# EAGLE design Adapter RepRap (EAGLE 8.1.1)
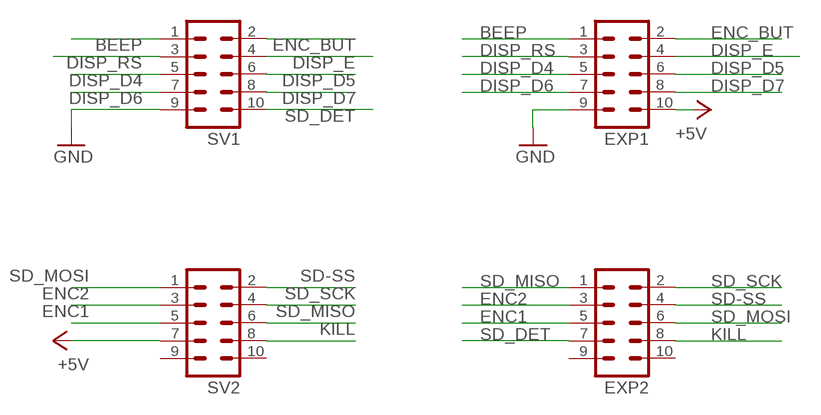
[diagram p0: schematic, sheet 1]

## Parts
EXP1  ML10  [ML10]
EXP2  ML10  [ML10]
SV1  ML10  [ML10]
SV2  ML10  [ML10]

## Nets
+5V: EXP1.10 SV2.7
BEEP: EXP1.1 SV1.1
DISP_D4: EXP1.5 SV1.5
DISP_D5: EXP1.6 SV1.6
DISP_D6: EXP1.7 SV1.7
DISP_D7: EXP1.8 SV1.8
DISP_E: EXP1.4 SV1.4
DISP_RS: EXP1.3 SV1.3
ENC1: EXP2.5 SV2.5
ENC2: EXP2.3 SV2.3
ENC_BUT: EXP1.2 SV1.2
GND: EXP1.9 SV1.9
KILL: EXP2.8 SV2.8
SD-SS: EXP2.4 SV2.2
SD_DET: EXP2.7 SV1.10
SD_MISO: EXP2.1 SV2.6
SD_MOSI: EXP2.6 SV2.1
SD_SCK: EXP2.2 SV2.4
Unconnected: EXP2.9 EXP2.10 SV2.9 SV2.10

## Library data of the parts
EXP1 EXP2 SV1 SV2 = con-harting-ml:ML10: HARTING; OC_FARNELL: unknown; OC_NEWARK: unknown

## Board
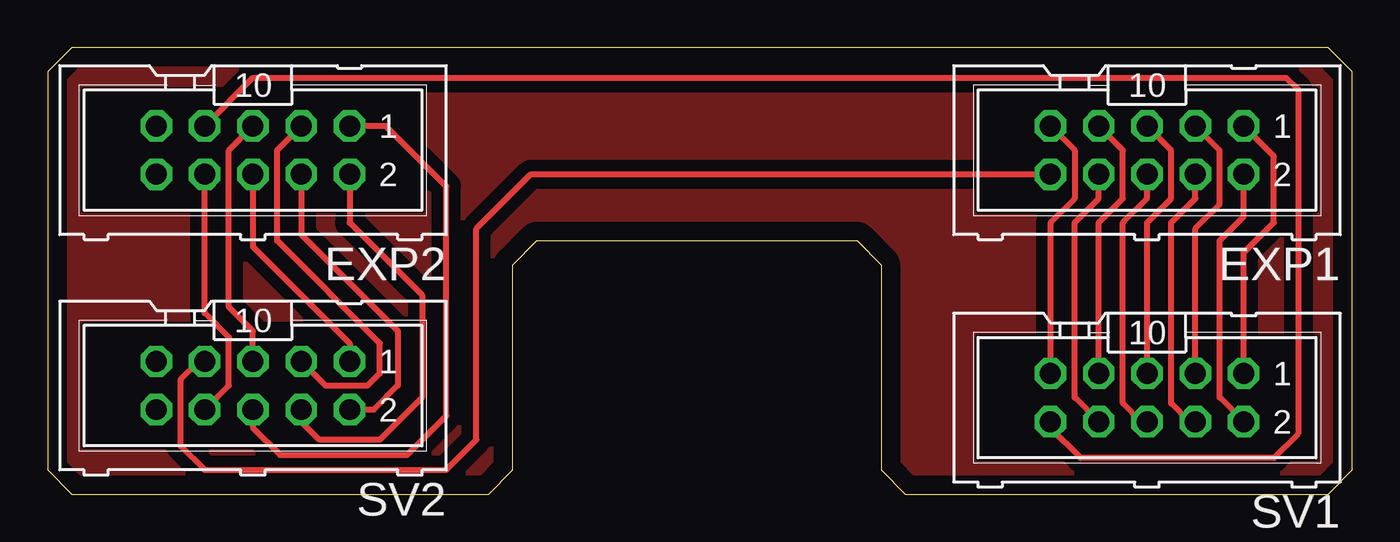
[diagram p1: board, top side]
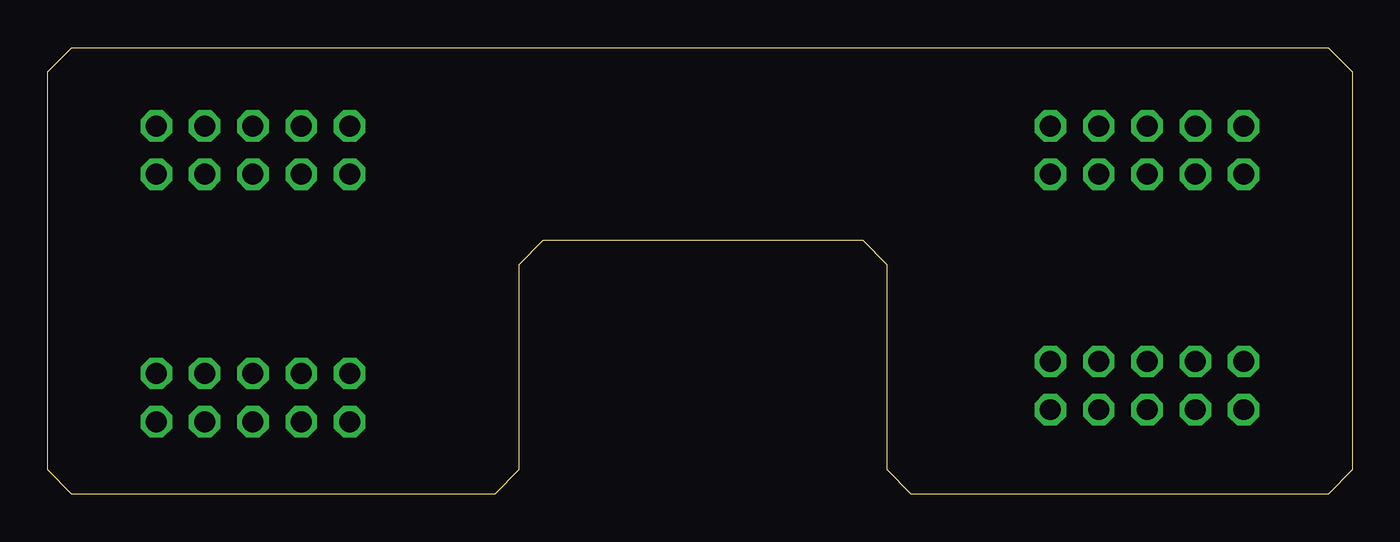
[diagram p2: board, bottom side, seen from below]

Size 68.58 x 23.5 mm. Coordinates in mm from the lower left corner, seen from the top.
Outline: 0,22.22 0,1.27 1.27,0 23.18,0 24.45,1.27 24.45,12.06 25.72,13.33 42.55,13.33 43.81,12.06 43.81,1.27 45.08,0 67.31,0 68.58,1.27 68.58,22.22 67.31,23.49 1.27,23.49 0,22.22
Copper layers (1*16): Top 0.035mm / dielectric 1.5mm / Bottom 0.035mm
Design rules "EagleDesignRules": minimum track width 0.2mm, minimum drill 0.3mm, track to track 0.2mm, track to pad 0.2mm, pad to pad 0.2mm, via to via 0.2mm, smd to smd 0.2mm, copper to edge 1mm, drill to drill 0.2mm, minimum pad ring 10mil, minimum via ring 8mil, stop-mask expansion 4mil, vias tented up to drill 0mil, thermal gap 0.25mm

### Footprints (pad centres in the part's own frame; a part is rotated, then mirrored left to right if it is on the bottom)
ML10 = drill 1.1 octagon: 1 -5.08,-1.27; 2 -5.08,1.27; 3 -2.54,-1.27; 4 -2.54,1.27; 5 0,-1.27; 6 0,1.27; 7 2.54,-1.27; 8 2.54,1.27; 9 5.08,-1.27; 10 5.08,1.27

### Placement (x,y rotation side)
EXP1  57.78,18.1 180 top
EXP2  10.8,18.1 180 top
SV1  57.78,5.08 180 top
SV2  10.8,5.71 180 top

### Tracks (layer width: path | path; a pad name or v marks a point on that pad's centre or on a via)
+5V
  Top 0.305: SV2.7 7.94,6.98 6.99,6.03 6.99,2.54 8.25,1.27 20.95,1.27 22.54,2.86 22.54,13.97 25.4,16.83 EXP1.10
BEEP
  Top 0.305: SV1.1 62.86,12.7 64.45,14.29 64.45,17.78 EXP1.1
DISP_D4
  Top 0.305: SV1.5 57.78,14.29 59.05,15.56 59.05,18.1 EXP1.5
DISP_D5
  Top 0.305: 57.47,3.81 56.52,4.76 56.52,14.29 57.78,15.56 EXP1.6
  Top 0.406: SV1.6 57.47,3.81
DISP_D6
  Top 0.305: SV1.7 55.25,14.29 56.52,15.56 56.52,18.1 EXP1.7
DISP_D7
  Top 0.305: SV1.8 53.97,5.08 53.97,14.29 55.25,15.56 EXP1.8
DISP_E
  Top 0.305: 60.01,3.81 59.05,4.76 59.05,14.29 60.33,15.56 EXP1.4
  Top 0.406: SV1.4 60.01,3.81
DISP_RS
  Top 0.305: SV1.3 60.33,13.97 61.59,15.24 61.59,18.1 EXP1.3
ENC1
  Top 0.305: SV2.5 10.8,8.57 9.52,9.84 9.52,18.1 EXP2.5
ENC2
  Top 0.305: SV2.3 14.6,5.72 16.83,5.72 17.46,6.35 17.46,7.94 12.06,13.33 12.06,18.1 EXP2.3
ENC_BUT
  Top 0.305: SV1.2 61.59,5.08 61.59,13.33 62.86,14.6 EXP1.2
GND
  Top 0.305: EXP1.9 53.97,18.1 53.97,15.56 52.7,14.29 SV1.9
KILL
  Top 0.305: SV2.8 9.52,5.72 9.52,8.25 8.25,9.53 EXP2.8
N$1
  pour Top (isolate 0.61): 1.27,23.5 67.31,23.5 68.58,22.23 68.58,1.27 67.31,0 45.08,0 43.81,1.27 43.81,12.06 42.55,13.33 25.72,13.33 24.45,12.06 24.45,1.27 23.18,0 1.27,0 0,1.27 0,22.23
N$2
  cutout Top (isolate 0.61): 1.9,21.27 19.69,21.27 19.69,14.92 1.9,14.92
N$3
  cutout Top (isolate 0.61): 48.89,14.92 66.67,14.92 66.67,21.27 48.89,21.27
N$4
  cutout Top (isolate 0.61): 48.89,1.91 66.67,1.91 66.67,8.25 48.89,8.25
N$5
  cutout Top (isolate 0.61): 1.9,2.54 19.69,2.54 19.69,8.89 1.9,8.89
SD-SS
  Top 0.305: EXP2.4 13.34,13.65 18.42,8.57 18.42,5.72 17.14,4.44 SV2.2
  Bottom 0.406: 16.19,4.44 SV2.2
SD_DET
  Top 0.305: EXP2.7 10.8,21.91 65.09,21.91 65.72,21.27 65.72,3.18 64.45,1.91 54.29,1.91 52.7,3.49 SV1.10
SD_MISO
  Top 0.305: SV2.6 10.8,3.49 12.22,2.06 18.89,2.06 20.95,4.13 20.95,16.19 17.78,19.37 EXP2.1
SD_MOSI
  Top 0.305: EXP2.6 10.8,13.02 15.88,7.94 SV2.1
SD_SCK
  Top 0.305: EXP2.2 15.88,14.29 19.69,10.48 19.69,5.08 17.46,2.86 14.29,2.86 13.34,3.81 SV2.4